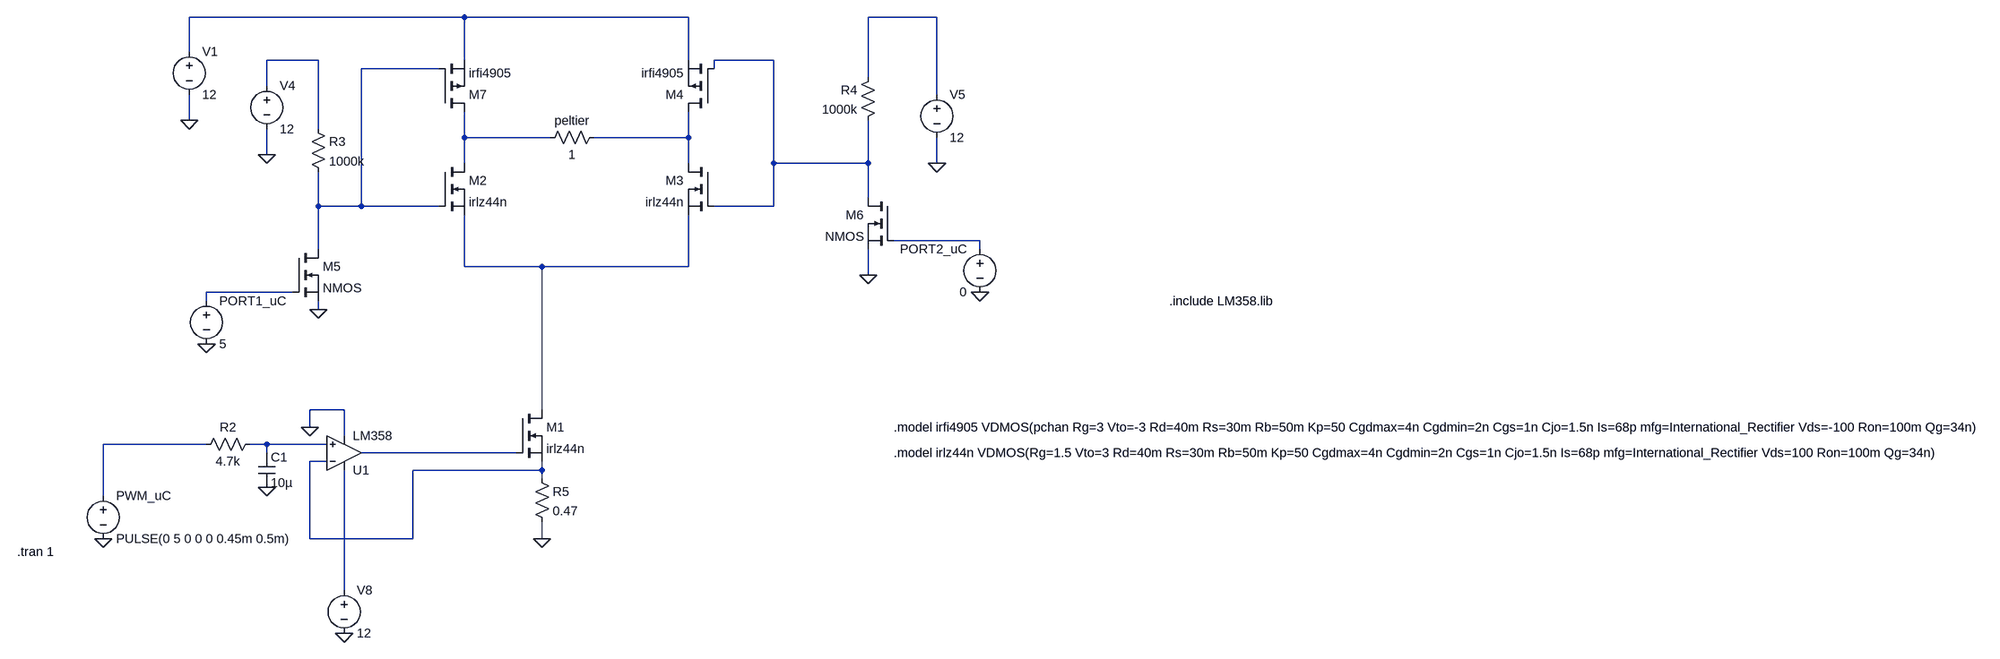
[diagram p0: schematic ReguladorDeCorriente.asc]
ReguladorDeCorriente.asc, the LTspice schematic file:
Version 4
SHEET 1 2720 692
WIRE -528 -720 -1040 -720
WIRE -112 -720 -528 -720
WIRE 432 -720 304 -720
WIRE -1040 -656 -1040 -720
WIRE -800 -640 -896 -640
WIRE -528 -640 -528 -720
WIRE -112 -640 -112 -720
WIRE 128 -640 -64 -640
WIRE -576 -624 -720 -624
WIRE -64 -624 -64 -640
WIRE 304 -608 304 -720
WIRE -896 -592 -896 -640
WIRE 432 -576 432 -720
WIRE -1040 -528 -1040 -576
WIRE -800 -512 -800 -640
WIRE -528 -496 -528 -544
WIRE -368 -496 -528 -496
WIRE -112 -496 -112 -544
WIRE -112 -496 -288 -496
WIRE -896 -464 -896 -512
WIRE -528 -448 -528 -496
WIRE -112 -448 -112 -496
WIRE 128 -448 128 -640
WIRE 304 -448 304 -528
WIRE 304 -448 128 -448
WIRE 432 -448 432 -496
WIRE 304 -384 304 -448
WIRE -800 -368 -800 -432
WIRE -720 -368 -720 -624
WIRE -720 -368 -800 -368
WIRE -576 -368 -720 -368
WIRE 128 -368 128 -448
WIRE 128 -368 -64 -368
WIRE 512 -304 352 -304
WIRE -800 -288 -800 -368
WIRE 512 -288 512 -304
WIRE -528 -256 -528 -352
WIRE -384 -256 -528 -256
WIRE -112 -256 -112 -352
WIRE -112 -256 -384 -256
WIRE 304 -240 304 -288
WIRE -848 -208 -1008 -208
WIRE -1008 -192 -1008 -208
WIRE -800 -176 -800 -192
WIRE -752 16 -816 16
WIRE -384 16 -384 -256
WIRE -816 48 -816 16
WIRE -752 64 -752 16
WIRE -1008 80 -1200 80
WIRE -896 80 -928 80
WIRE -784 80 -896 80
WIRE -896 96 -896 80
WIRE -432 96 -720 96
WIRE -784 112 -816 112
WIRE -384 128 -384 112
WIRE -384 128 -624 128
WIRE -384 144 -384 128
WIRE -1200 176 -1200 80
WIRE -816 256 -816 112
WIRE -624 256 -624 128
WIRE -624 256 -816 256
WIRE -384 256 -384 224
WIRE -752 352 -752 128
FLAG -384 256 0
FLAG -1040 -528 0
FLAG -1200 256 0
FLAG -752 432 0
FLAG -896 160 0
FLAG -816 48 0
FLAG -1008 -112 0
FLAG 512 -208 0
FLAG 304 -240 0
FLAG -800 -176 0
FLAG -896 -464 0
FLAG 432 -448 0
SYMBOL nmos -432 16 R0
SYMATTR InstName M1
SYMATTR Value irlz44n
SYMBOL pmos -64 -544 R180
SYMATTR InstName M4
SYMATTR Value irfi4905
SYMBOL voltage -1040 -672 R0
SYMATTR InstName V1
SYMATTR Value 12
SYMBOL res -272 -512 R90
WINDOW 0 0 56 VBottom 2
WINDOW 3 32 56 VTop 2
SYMATTR InstName peltier
SYMATTR Value 1
SYMBOL nmos -576 -448 R0
SYMATTR InstName M2
SYMATTR Value irlz44n
SYMBOL nmos -64 -448 M0
SYMATTR InstName M3
SYMATTR Value irlz44n
SYMBOL pmos -576 -544 M180
SYMATTR InstName M7
SYMATTR Value irfi4905
SYMBOL voltage -1200 160 R0
WINDOW 123 0 0 Left 2
WINDOW 39 0 0 Left 2
SYMATTR InstName PWM_uC
SYMATTR Value PULSE(0 5 0 0 0 0.45m 0.5m)
SYMBOL voltage -752 336 R0
SYMATTR InstName V8
SYMATTR Value 12
SYMBOL cap -912 96 R0
SYMATTR InstName C1
SYMATTR Value 10µ
SYMBOL res -912 64 R90
WINDOW 0 0 56 VBottom 2
WINDOW 3 32 56 VTop 2
SYMATTR InstName R2
SYMATTR Value 4.7k
SYMBOL Opamps\\opamp2 -752 160 M180
SYMATTR InstName U1
SYMATTR Value LM358
SYMBOL voltage -1008 -208 R0
SYMATTR InstName PORT1_uC
SYMATTR Value 5
SYMBOL nmos -848 -288 R0
SYMATTR InstName M5
SYMBOL res -816 -528 R0
SYMATTR InstName R3
SYMATTR Value 1000k
SYMBOL voltage 512 -304 M0
SYMATTR InstName PORT2_uC
SYMATTR Value 0
SYMBOL nmos 352 -384 M0
SYMATTR InstName M6
SYMBOL res 320 -624 M0
SYMATTR InstName R4
SYMATTR Value 1000k
SYMBOL voltage -896 -608 R0
SYMATTR InstName V4
SYMATTR Value 12
SYMBOL voltage 432 -592 R0
SYMATTR InstName V5
SYMATTR Value 12
SYMBOL res -400 128 R0
SYMATTR InstName R5
SYMATTR Value 0.47
TEXT 352 96 Left 2 !.model irlz44n VDMOS(Rg=1.5 Vto=3 Rd=40m Rs=30m Rb=50m Kp=50 Cgdmax=4n Cgdmin=2n Cgs=1n Cjo=1.5n Is=68p mfg=International_Rectifier Vds=100 Ron=100m Qg=34n)
TEXT 352 48 Left 2 !.model irfi4905 VDMOS(pchan Rg=3 Vto=-3 Rd=40m Rs=30m Rb=50m Kp=50 Cgdmax=4n Cgdmin=2n Cgs=1n Cjo=1.5n Is=68p mfg=International_Rectifier Vds=-100 Ron=100m Qg=34n)
TEXT -1360 280 Left 2 !.tran 1
TEXT 864 -192 Left 2 !.include LM358.lib

The netlist it stands for:
* ReguladorDeCorriente.asc
M1 N009 N013 N014 N014 irlz44n
M4 N007 N004 N001 N001 irfi4905
V1 N001 0 12
R§peltier N007 N006 1
M2 N006 N005 N009 N009 irlz44n
M3 N007 N004 N009 N009 irlz44n
M7 N006 N005 N001 N001 irfi4905
V§PWM_uC N011 0 PULSE(0 5 0 0 0 0.45m 0.5m)
V8 N015 0 12
C1 N012 0 10µ
R2 N012 N011 4.7k
XU1 N012 N014 N015 0 N013 LM358  ; pins In+ In- V+ V- OUT
V§PORT1_uC N010 0 5
M5 N005 N010 0 0 NMOS
R3 N003 N005 1000k
V§PORT2_uC N008 0 0
M6 N004 N008 0 0 NMOS
R4 N002 N004 1000k
V4 N003 0 12
V5 N002 0 12
R5 N014 0 0.47
.model NMOS NMOS
.model PMOS PMOS
.lib standard.mos
.model irlz44n VDMOS(Rg=1.5 Vto=3 Rd=40m Rs=30m Rb=50m Kp=50 Cgdmax=4n Cgdmin=2n Cgs=1n Cjo=1.5n Is=68p mfg=International_Rectifier Vds=100 Ron=100m Qg=34n)
.model irfi4905 VDMOS(pchan Rg=3 Vto=-3 Rd=40m Rs=30m Rb=50m Kp=50 Cgdmax=4n Cgdmin=2n Cgs=1n Cjo=1.5n Is=68p mfg=International_Rectifier Vds=-100 Ron=100m Qg=34n)
.tran 1
.include LM358.lib
.backanno
.end